# EAGLE design Adafruit MPR pressure sensor (EAGLE 9.1.1)
COMPANY: ADAFRUIT INDUSTRIES; DRAWN: KTOWN; REV: A
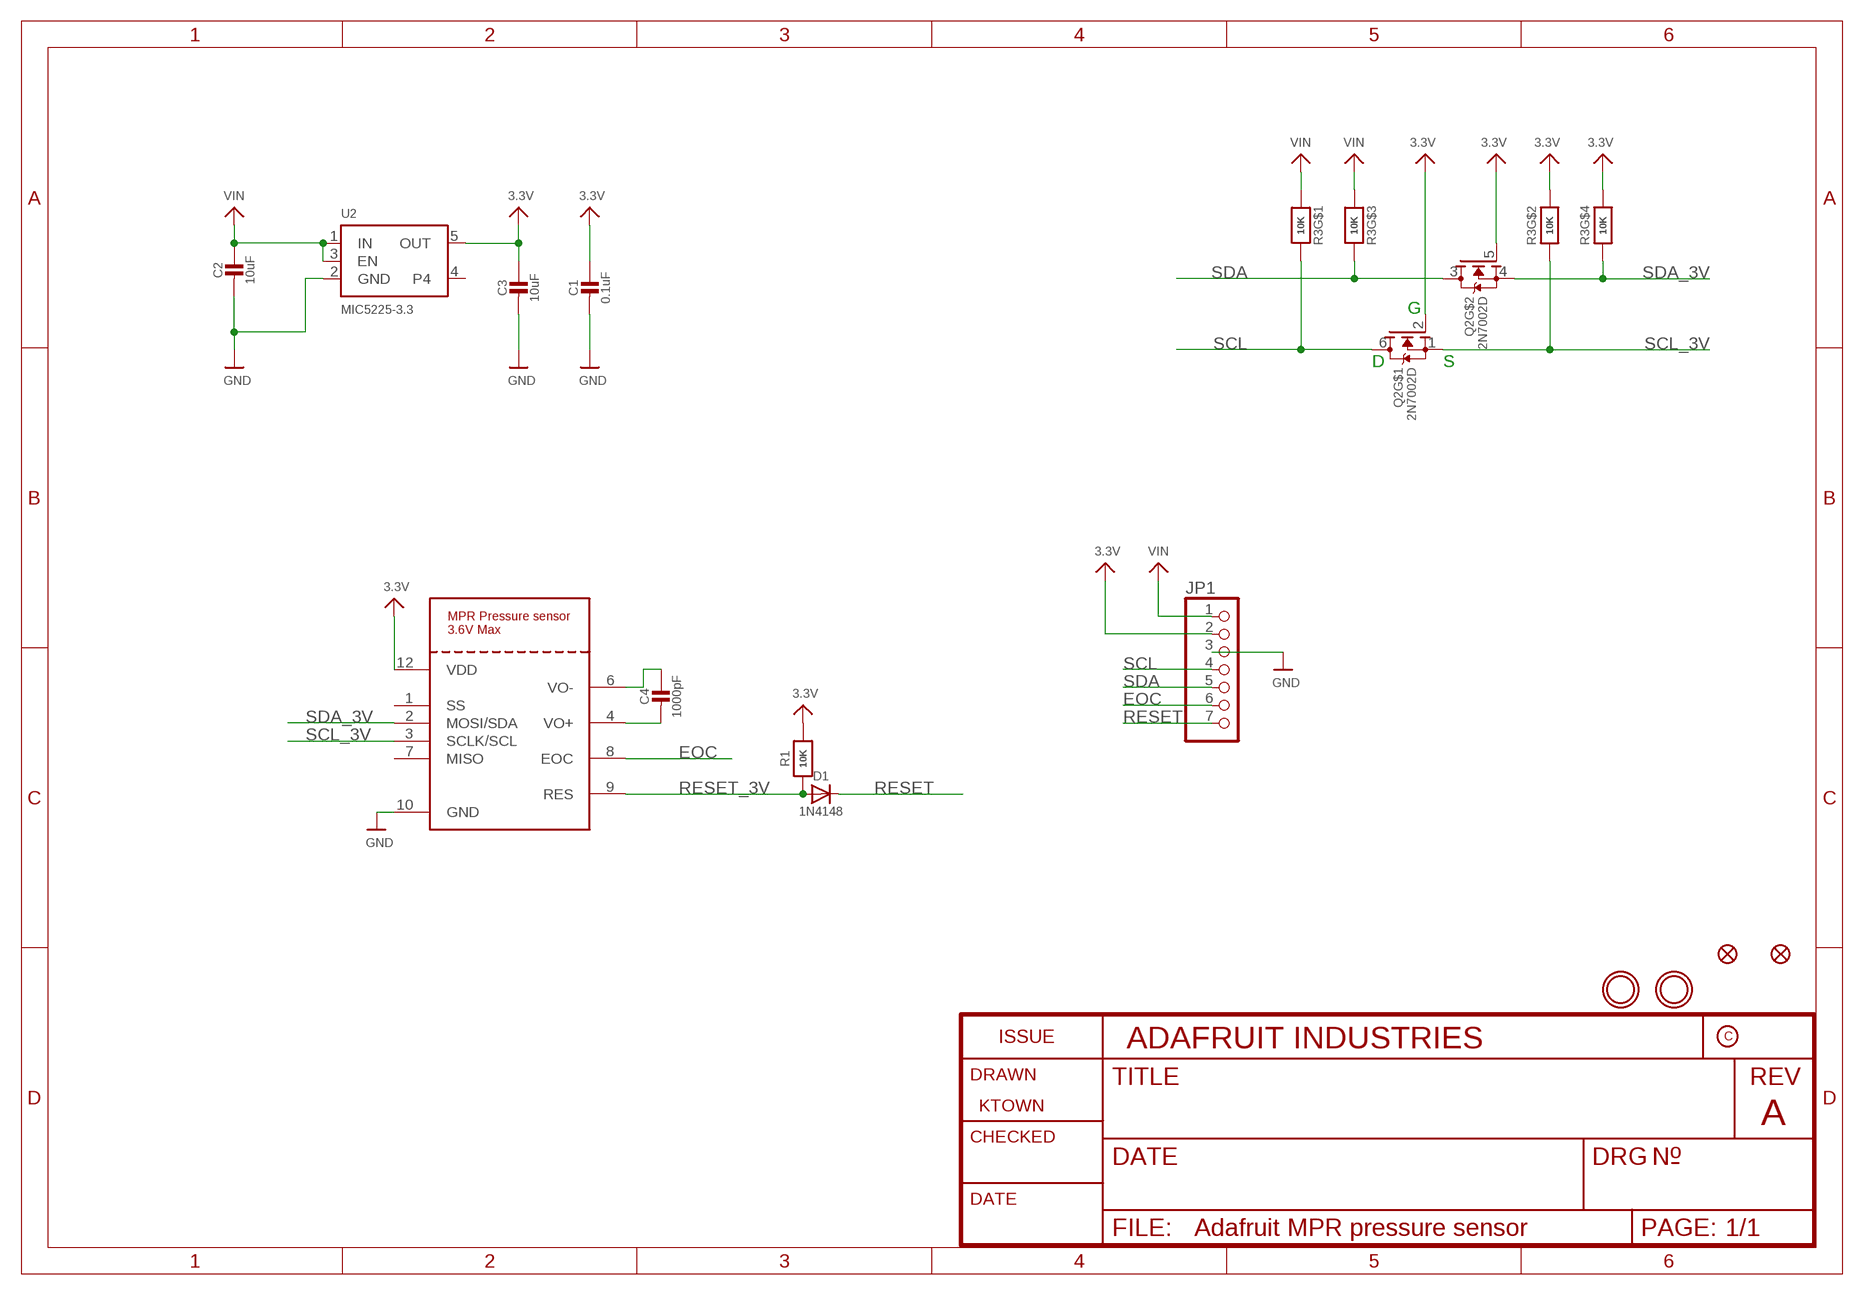
[diagram p0: schematic, sheet 1]

## Parts
C1  0.1uF  CAP_CERAMIC0603_NO  [0603-NO]
C2  10uF  CAP_CERAMIC0805-NOOUTLINE  [0805-NO]
C3  10uF  CAP_CERAMIC0805-NOOUTLINE  [0805-NO]
C4  1000pF  CAP_CERAMIC0603_NO  [0603-NO]
D1  1N4148  DIODESOD-323  [SOD-323]
FID1  FIDUCIAL_1MM  [FIDUCIAL_1MM]
FID2  FIDUCIAL_1MM  [FIDUCIAL_1MM]
JP1  HEADER-1X770MIL  [1X07_ROUND_70]
Q2  2N7002D  MOSFET-N_DUAL  [SOT363]
R1  10K  RESISTOR_0603_NOOUT  [0603-NO]
R3  10K  RESISTOR_4PACK  [RESPACK_4X0603]
U2  MIC5225-3.3  VREG_SOT23-5  [SOT23-5]
U$3  MOUNTINGHOLE2.5  [MOUNTINGHOLE_2.5_PLATED]
U$4  MOUNTINGHOLE2.5  [MOUNTINGHOLE_2.5_PLATED]
U$18  MPR_SERIES_I2C_PRESSURE  [MPR_SERIES_I2C_PRESSURE]

## Nets
3.3V: C1.1 C3.1 JP1.2 Q2.2(G) Q2.5(G) R1.2 R3.2 R3.4 U2.5(OUT) U$18.12(VDD)
EOC: JP1.6 U$18.8(EOC)
GND: C1.2 C2.2 C3.2 JP1.3 U2.2(GND) U$18.10(GND)
N$1: C4.2 U$18.4(VO+)
N$2: C4.1 U$18.6(VO-)
RESET: D1.C JP1.7
RESET_3V: D1.A R1.1 U$18.9(RES)
SCL: JP1.4 Q2.6(D) R3.8
SCL_3V: Q2.1(S) R3.7 U$18.3(SCLK/SCL)
SDA: JP1.5 Q2.3(D) R3.6
SDA_3V: Q2.4(S) R3.5 U$18.2(MOSI/SDA)
VIN: C2.1 JP1.1 R3.1 R3.3 U2.1(IN) U2.3(EN)
Unconnected: U2.4 U$18.1(SS) U$18.7(MISO)

## Notes on the sheet
- G
- D | S

## Library data of the parts
C1-C4 = microbuilder:CAP_CERAMIC: Ceramic Capacitors For new designs, use the packages preceded by an '_' character since they are more reliable: The following footprints should be used on most boards: _0402 - Standard footprint for regular board layouts _0603 - Standard footprint for regular board layouts _0805 - Standard footprint for regular board layouts _1206 - Standard footprint for regular board layouts For extremely tight-pitch boards where space is at a premium, the following 'micro-pitch' footprints can be used (smaller pads, no silkscreen outline, etc.): _0402MP - Micro-pitch footprint for very dense/compact boards _0603MP - Micro-pitch footprint for very dense/compact boards _0805MP - Micro-pitch footprint for very dense/compact boards _1206MP - Micro-pitch footprint for very dense/compact boards
D1 = microbuilder:DIODE: Diode SMA Model Volts Amps Type Vf Ir Digikey # Notes SSA34-E3 40V 3A Schottky 480mV @ 3A 200uA @ 40V SSA34-E3/61TGITR-ND CDBA120-G 20V 1A Schottky 500mV @ 1A 500uA @ 20V 641-1014-6-ND REEL MBRA210 10V 2A Schottky 350mV @ 2A 700uA @ 10V MBRA210LT3 SOD-123 Model Volts Amps Type Vf Ir Order # Notes BAT54T1G 30V 200mA Schottky 800mV @ 200mA 2uA @ 25V BAT54T1GOSTR-ND B0530W 30V 500mA Schottky 430mV @ 500mA 130uA @ 30V B0530W-FDICT-ND REEL MBR120 20V 1A Schottky 340mV @ 1A MBR120VLSFT1GOSCT-ND SOD-323 Model Volts Amps Type Vf Ir Order # Notes PMEG2005EJ 20V 500mA Schottky 355mV @ 500mA 568-4110-1-ND ZLLS410 10V 570mA Schottky 380mV @ 570mA ZLLS410CT-ND 1N4148WS 75V 150mA Silicon/Simple 1V 1N4148WSFSCT-ND REEL SOD-523 Model Volts Amps Type Vf Ir Order # Notes BAT54XV2 30V 200mA Schottky 0.8V @ 100mA BAT54XV2CT-ND TB751S 30V 30mA Schottky RB751S-40TE61CT-ND SOT23-R/W (R = Solder Paste/Reflow Ovens, W = Hand-Soldering) Model Volts Amps Type Vf Ir Order # Notes BAT54FILM 40V 300mA Schottky 497-7162-1-ND POWERDI-5 Model Volts Amps Type Vf Ir Order # Notes PDS560 60V 5A Schottky 670mV @ 5A 150uA @ 60V PDS560DICT-ND
FID1 FID2 = microbuilder:FIDUCIAL: Fiducial Alignment Points Various fiducial points for machine vision alignment.; BOM: EXCLUDE
JP1 = microbuilder:HEADER-1X7: PIN HEADER
Q2 = microbuilder:MOSFET-N_DUAL: Dual N-Channel MOSFET SOT363 (2.0x1.25mm) 2N7002PS - 60V, 320mA [Digikey: 568-5984-1-ND]
R1 = microbuilder:RESISTOR: Resistors For new designs, use the packages preceded by an '_' character since they are more reliable: The following footprints should be used on most boards: _0402 - Standard footprint for regular board layouts _0603 - Standard footprint for regular board layouts _0805 - Standard footprint for regular board layouts _1206 - Standard footprint for regular board layouts For extremely tight-pitch boards where space is at a premium, the following 'micro-pitch' footprints can be used (smaller pads, no silkscreen outline, etc.): _0402MP - Micro-pitch footprint for very dense/compact boards _0603MP - Micro-pitch footprint for very dense/compact boards _0805MP - Micro-pitch footprint for very dense/compact boards _1206MP - Micro-pitch footprint for very dense/compact boards
R3 = microbuilder:RESISTOR_4PACK: Resistor Packs (4 resistors) 4 x 0603 10K 1/16W - Digikey: YC164J-10KCT-ND
U2 = microbuilder:VREG_SOT23-5: SOT23-5 Fixed Voltage Regulators Part Current Out V Out V In V Dropout θJA (°C/W) TJ (°C) Digikey Part No. ADP121 150mA 3.3V 3.4-5.5V 0.09V @ 150mA -- -- ADP121-AUJZ33R7CT-ND ADP121 150mA 3.0V 3.1-5.5V 0.09V @ 150mA -- -- ADP121-AUJZ30R7CT-ND ADP122 300mA 3.3V 3.4-5.5V 0.085V @ 300mA -- -- ADP122AUJZ-3.3-R7CT-ND ADP1712 300mA 3.3V 3.5-5.5V 0.17V @ 300mA -- -- ADP1712AUJZ-3.3-R7TR-ND AP7311 (Low Cost) 150mA 3.3V 3.5-6V 0.15V @ 150mA -- -- AP7311-33WG-7DICT-ND LD39015M18R 150mA 1.8V 1.9V-5.5V 0.08V @ 100mA -- -- 497-6977-1-ND LP2985A-33DBVR 150mA 3.3V 3.3-16V 0.28V @ 150mA 206 150 296-18479-1-ND MCP1824T-3302E/OT 300mA 3.3V 3.5V-6V 0.2V @ 300mA -- -- MCP1824T-3302E/OTCT-ND MIC5205-2.5YM5 TR 150mA 2.5V 2.7-16V 0.165V @ 150mA -- -- 576-1257-2-ND MIC5205-3.0YM5 TR 150mA 3.0V 3.2V-16V 0.165V @ 150mA -- -- 576-1258-2-ND MIC5205-3.3YM5 TR 150mA 3.3V 3.5V-16V 0.165V @ 150mA -- -- 576-1259-2-ND TPS780330220 150mA 3.3V+2.2V 3.6-5.5V 250mV Max -- -- 296-23332-1-ND TDA3663/N1,135 100mA 3.3V 3.5-45V 0.18V @ 50mA -- -- 568-5343-1-ND Max operating temp can be calculated using θJA, TJ (max junction temperature), and power in watts. Set the "Maximum Ambient Temperature" until it reaches TJ ("Max Junction Temperature"), which is the absolute limit for safe use of the regulator: Heat Sink Temperature Calculator <http://www.daycounter.com/Calculators/Heat-Sink-Temperature-Calculator.phtml> For example, With 12V source into a 3.3V LP2985 and a 30mA load, we are dissipating (12V-3.3V) * 0.03A = 0.261W. With a θJA of 206 °C/W, a TJ of 150°C, and 261mW we can safely use the chip without a heat sink up to 75°C (=147.1°C Junction Temperature).
U$3 U$4 = microbuilder:MOUNTINGHOLE: Mounting Hole For #2 screws (0.086"/2.18mm width, 0.094"/2.4mm hole) use 2.5mm; BOM: EXCLUDE
U$18 = microbuilder:MPR_SERIES_I2C_PRESSURE: I2C piezoresistive silicon pressure sensor

## Board
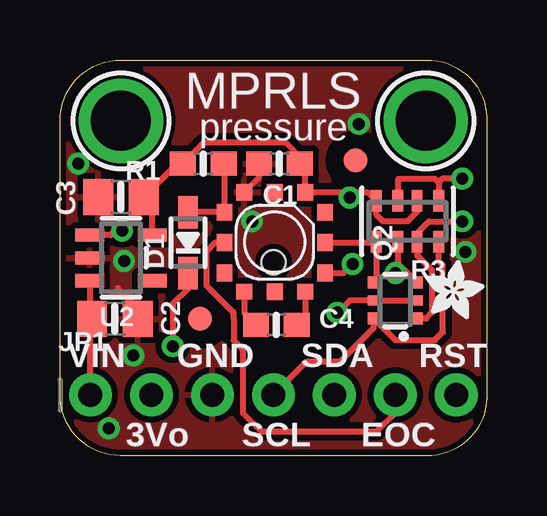
[diagram p1: board, top side]
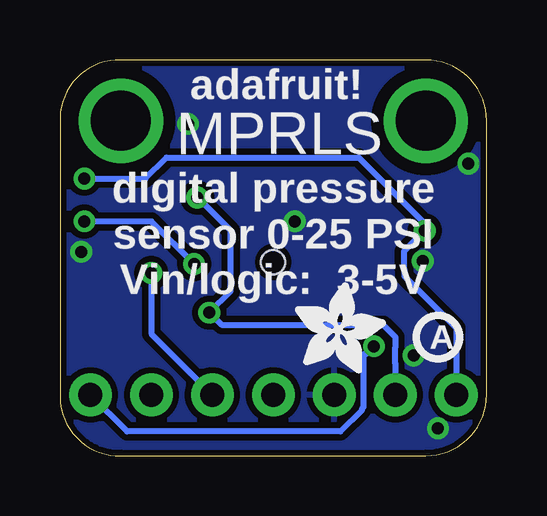
[diagram p2: board, bottom side, seen from below]

Size 17.78 x 16.51 mm. Coordinates in mm from the lower left corner, seen from the top.
Outline: 17.78,14.1 17.78,2.41 arc-90 15.24,0 2.54,0 arc-90 0,2.54 0,13.97 arc-90 2.54,16.51 15.24,16.51 arc-90 17.78,14.1
Copper layers (1*16): Top 0.035mm / dielectric 1.5mm / Bottom 0.035mm
Design rules "adafruit *": minimum track width 8mil, minimum drill 15.5mil, track to track 8mil, track to pad 8mil, pad to pad 8mil, via to via 8mil, smd to smd 8mil, copper to edge 10mil, drill to drill 8mil, minimum pad ring 10mil, minimum via ring 8mil, stop-mask expansion 2mil, vias tented up to drill 20mil, thermal gap 10mil

### Footprints (pad centres in the part's own frame; a part is rotated, then mirrored left to right if it is on the bottom)
0603-NO = smd 1.075 x 1: 1 -0.85,0; 2 0.85,0
0805-NO = smd 1.24 x 1.5: 1 -0.95,0; 2 0.95,0
SOD-323 = smd 1.35 x 0.8: A 1.27,0; C -1.27,0
FIDUCIAL_1MM = smd 1 x 1: 1 0,0
1X07_ROUND_70 = drill 1 pad 1.778: 1 -7.62,0; 2 -5.08,0; 3 -2.54,0; 4 0,0; 5 2.54,0; 6 5.08,0; 7 7.62,0
SOT363 = smd 0.5 x 0.5: 1 -0.75,-0.9; 3 0.75,-0.9; 4 0.75,0.9; 6 -0.75,0.9 | smd 0.4 x 0.5: 2 0,-0.9; 5 0,0.9
RESPACK_4X0603 = smd 0.45 x 0.9: 1 -1.3,-0.85; 2 -0.4,-0.85; 3 0.4,-0.85; 4 1.3,-0.85; 5 1.3,0.85; 6 0.4,0.85; 7 -0.4,0.85; 8 -1.3,0.85
SOT23-5 = smd 0.55 x 1.2: 1 -0.95,-1.3; 2 0,-1.3; 3 0.95,-1.3; 4 0.95,1.3; 5 -0.95,1.3
MOUNTINGHOLE_2.5_PLATED = drill 2.5 pad 3.2: P$1 0,0
MPR_SERIES_I2C_PRESSURE = smd 0.7 x 0.65: 1 -1.27,2.159; 2 0,2.159; 3 1.27,2.159; 5 2.05,0.059; 7 1.27,-2.041; 8 0,-2.041; 9 -1.27,-2.041; 10 -2.1,-1.211; 11 -2.1,0.059; 12 -2.1,1.329 | smd 0.65 x 0.65: 4 2.05,1.329; 6 2.05,-1.211 | hole 1: 0.81,0.009

### Placement (x,y rotation side)
C1  9.14,12.19 180 top
C2  2.29,5.71 0 top
C3  2.54,10.79 180 top
C4  9.02,5.46 0 top
D1  5.33,8.89 90 top
FID1  12.32,12.32 0 top
FID2  5.84,5.71 0 top
JP1  8.89,2.54 0 top
Q2  13.97,6.48 90 top
R1  5.97,12.19 180 top
R3  14.48,9.78 180 top
U2  2.54,8.26 270 top
U$1  [ADAFRUIT_3.5MM]  8,3.43 0 bottom
U$3  2.54,13.97 0 top
U$4  15.24,13.97 0 top
U$8  [ADAFRUIT_2.5MM]  15.24,5.71 0 top
U$18  8.89,8.89 270 top
U$27  [PCBFEAT-REV-040]  2.03,4.95 0 bottom

### Tracks (layer width: path | path; a pad name or v marks a point on that pad's centre or on a via)
3.3V  (via drill 0.5)
  Top 0.254: R3.2 14.88,10.18 14.48,9.78 13.46,9.78 13.18,10.06 R3.4 12.82,10.99 12.06,10.99 | Q2.2 Q2.5 12.06,6.48 v11.56,5.97 | 12.06,10.99 U$18.12 10.22,11.97 C1.1 9.99,12.48 9.4,13.08 6.01,13.08 R1.2 4.89,12.19 C3.1 3.84,10.45 U2.5 | v12.06,10.77 12.06,10.99
  Bottom 0.254: v12.06,10.77 12.06,10.79 10.67,9.4 10.67,6.86 v11.56,5.97 11.05,5.46 4.32,5.46 3.81,4.95 3.81,4.54 3.83,4.52 3.83,3.87 3.81,3.85 JP1.2
EOC
  Top 0.254: U$18.8 6.48,8.89 6.1,8.51 6.1,7.11 7.22,5.99 7.22,5.76 7.24,5.74 7.24,4.83 7.62,4.45 7.62,1.78 8.38,1.02 13.21,1.02 13.97,1.78 JP1.6
GND  (via drill 0.5)
  Top 0.254: C2.2 3.24,6.16 2.41,6.99 | U$18.10 8.29,11.61 C1.2
  other vias: 16.89,8.51 8,9.78 2.67,8.13 12.45,13.84 0.76,12.19 2.03,1.14 3.05,4.19
  pour Top (isolate 0.254): 0,0 0,16.51 17.78,16.51 17.78,0
  pour Bottom (isolate 0.254): 0,0 0,16.51 17.78,16.51 17.78,0
N$1
  Top 0.254: U$18.4 10.22,5.81 C4.2
N$2
  Top 0.254: U$18.6 7.68,5.95 C4.1
RESET  (via drill 0.5)
  Top 0.254: D1.C 5.33,6.99 4.7,6.35 v4.7,4.57
  Bottom 0.254: JP1.7 14.99,1.02 6.1,1.02 5.21,1.91 5.21,1.96 5.13,2.04 5.13,4.24 5.03,4.24 v4.7,4.57
RESET_3V
  Top 0.254: D1.A U$18.9 6.85,12.16 R1.1
SCL
  Top 0.254: R3.8 15.78,8.11 15.95,7.94 15.95,5.16 15.62,4.83 13.97,4.83 Q2.6 13.07,5.32 11.68,3.94 10.29,3.94 JP1.4
SCL_3V  (via drill 0.5)
  Top 0.254: Q2.1 15.25,5.73 15.49,5.97 15.49,7.75 14.88,8.36 R3.7 14.88,9.29 15.37,9.78 v16.76,9.78 | U$18.3 11.81,7.62 v12.19,8
  Bottom 0.254: v16.76,9.78 13.97,9.78 v12.19,8
SDA  (via drill 0.5)
  Top 0.254: R3.6 14.08,8.02 14.1,8 14.1,7.74 v13.98,7.62 | 14.1,8 Q2.3
  Bottom 0.254: v13.98,7.62 13.98,5.09 JP1.5
SDA_3V
  Top 0.254: Q2.4 13.18,7.33 R3.5 13.14,8.89 U$18.2
VIN  (via drill 0.5)
  Top 0.254: 15.78,11.4 15.62,11.56 14.1,11.56 14.1,10.65 R3.3 | 15.78,11.4 R3.1 | v16.76,11.56 15.94,11.56 15.78,11.4 | U2.1 2.1,9.21 2.28,9.39 v2.58,9.39 2.54,9.35 | U2.3 1.24,5.81 C2.1 1.27,5.65 JP1.1
  Bottom 0.254: v16.76,11.56 14.22,11.56 13.34,12.45 5.33,12.45 2.58,9.7 v2.58,9.39 3.45,8.52 3.45,7.8 3.43,7.78 3.43,7.49 1.27,5.33 JP1.1

### Text on the board
tPlace: MPRLS | pressure | VIN | GND | SDA | RST | 3Vo | SCL | EOC
bPlace: adafruit! | MPRLS | digital pressure / sensor 0-25 PSI / Vin/logic: 3-5V